# EAGLE schematic 702_universal_serial (EAGLE 7.4.0)
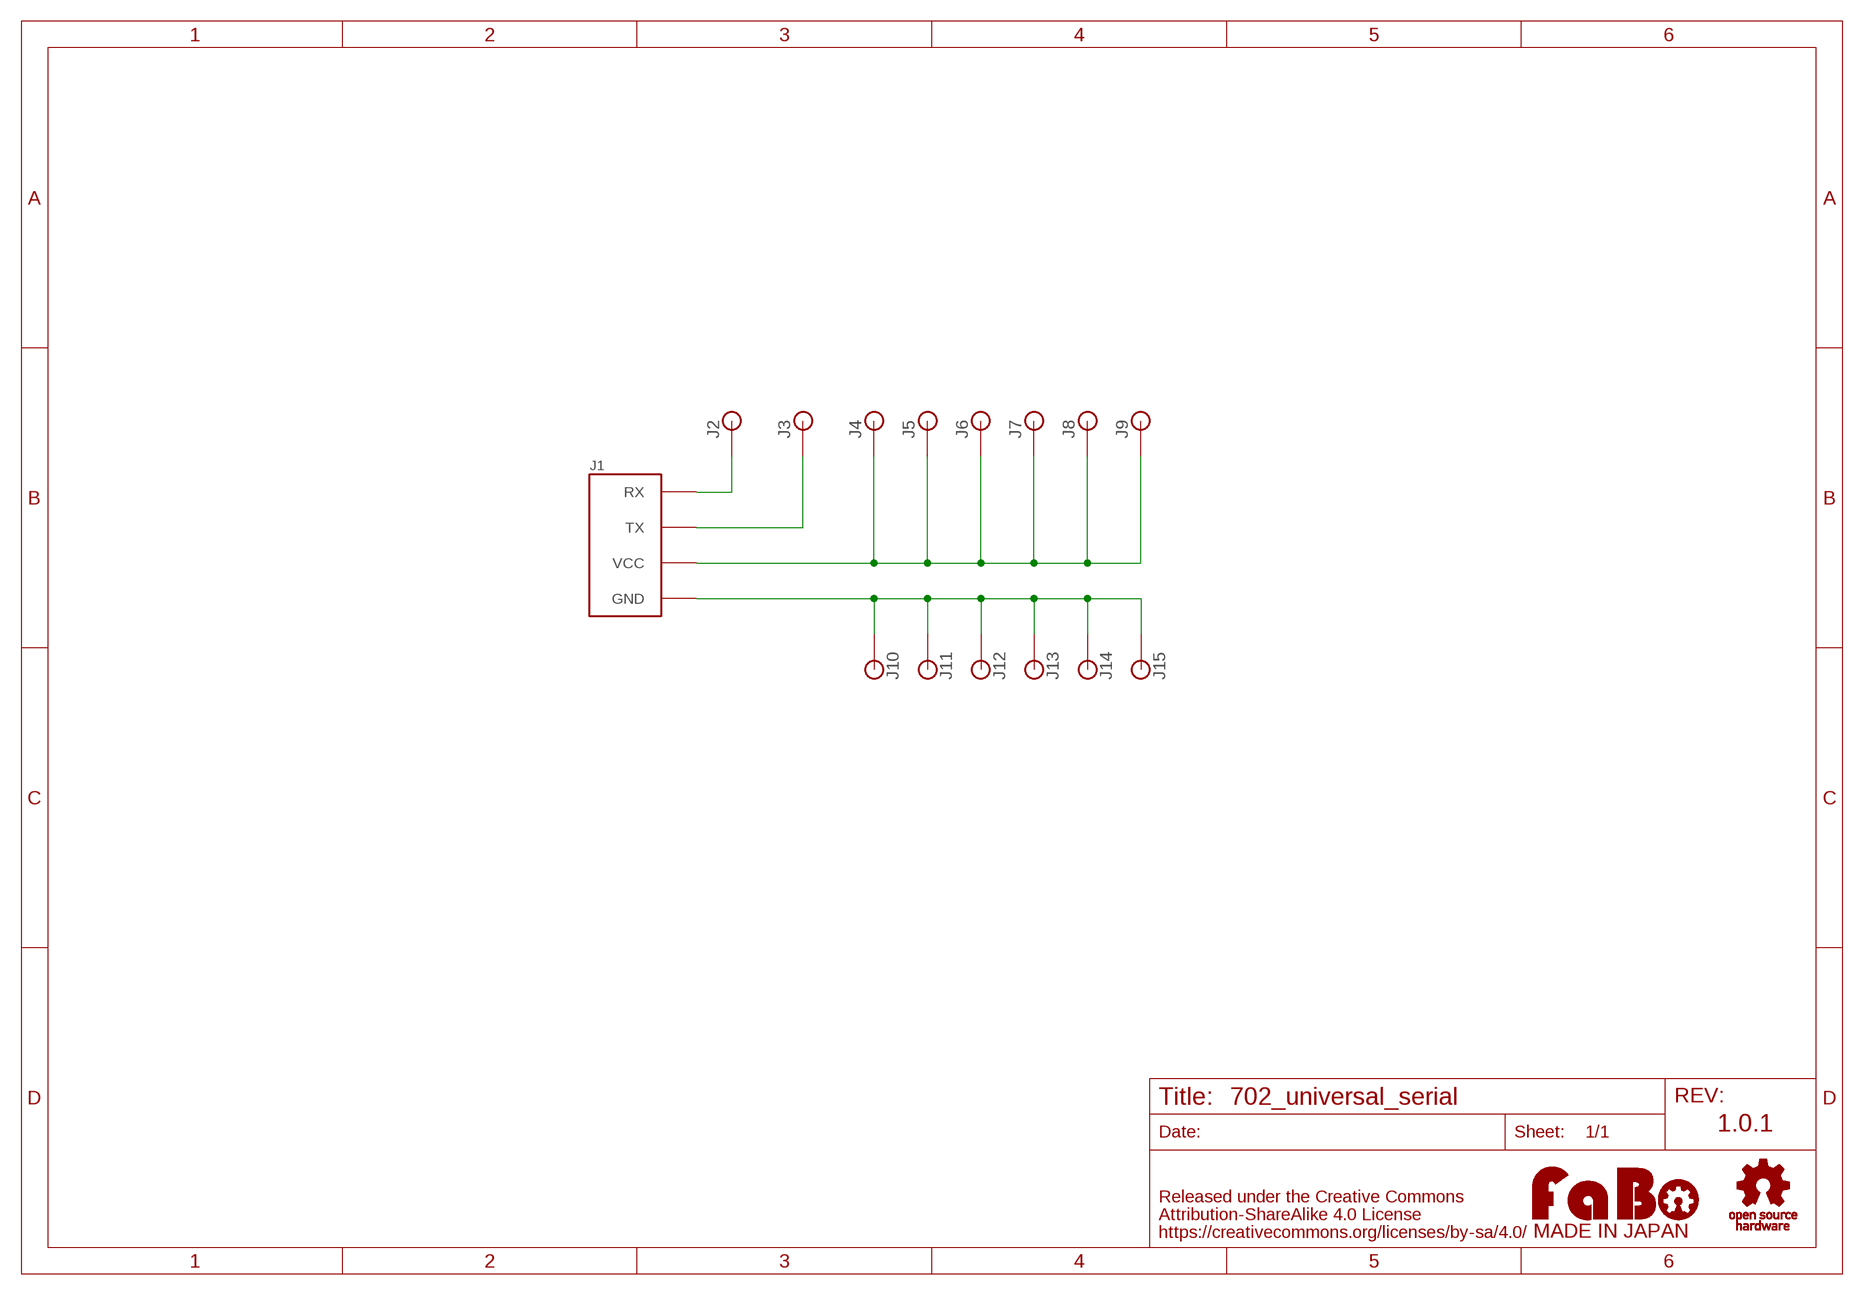
[diagram p0: schematic, sheet 1]

## Parts
J1  FABO_BRICK_SERIAL-UNIVERSAL  [FABO_BRICK_SERIAL_UNIVERSAL]
J2  PINHEAD_1X1-NONAME  [PIN_1X1_NONAME]
J3  PINHEAD_1X1-NONAME  [PIN_1X1_NONAME]
J4  PINHEAD_1X1-NONAME  [PIN_1X1_NONAME]
J5  PINHEAD_1X1-NONAME  [PIN_1X1_NONAME]
J6  PINHEAD_1X1-NONAME  [PIN_1X1_NONAME]
J7  PINHEAD_1X1-NONAME  [PIN_1X1_NONAME]
J8  PINHEAD_1X1-NONAME  [PIN_1X1_NONAME]
J9  PINHEAD_1X1-NONAME  [PIN_1X1_NONAME]
J10  PINHEAD_1X1-NONAME  [PIN_1X1_NONAME]
J11  PINHEAD_1X1-NONAME  [PIN_1X1_NONAME]
J12  PINHEAD_1X1-NONAME  [PIN_1X1_NONAME]
J13  PINHEAD_1X1-NONAME  [PIN_1X1_NONAME]
J14  PINHEAD_1X1-NONAME  [PIN_1X1_NONAME]
J15  PINHEAD_1X1-NONAME  [PIN_1X1_NONAME]
U$2  LOGO_OSHW-S_BOTTOM  [LOGO_OSHW_S_BOTTOM]
U$3  LOGO_FABO-M_BOTTOM  [LOGO_FABO_MS_BOTTOM]

## Nets
GND: J1.GND J10.1 J11.1 J12.1 J13.1 J14.1 J15.1
RX: J1.RX J2.1
TX: J1.TX J3.1
VCC: J1.VCC J4.1 J5.1 J6.1 J7.1 J8.1 J9.1

## Notes on the sheet
- 1.0.1

## Library data of the parts
J1 = FaBo-Template:FABO_BRICK_SERIAL: FaBo Brick Serial
J2-J15 = FaBo-etc:PINHEAD_1X1
U$2 = FaBo-etc:LOGO_OSHW
U$3 = FaBo-etc:LOGO_FABO